# Altium schematic sheet Motor_Drive.SchDoc: TITRE
size Letter; ApprovedBy: APPROUVÉ PAR; Organization: Cegep Limoilou; Address1: 1300, 8e Avenue; Address2: Québec, QC; Address3: Canada; Address4: G1J 5L5; SheetNumber: 3; SheetTotal: 3
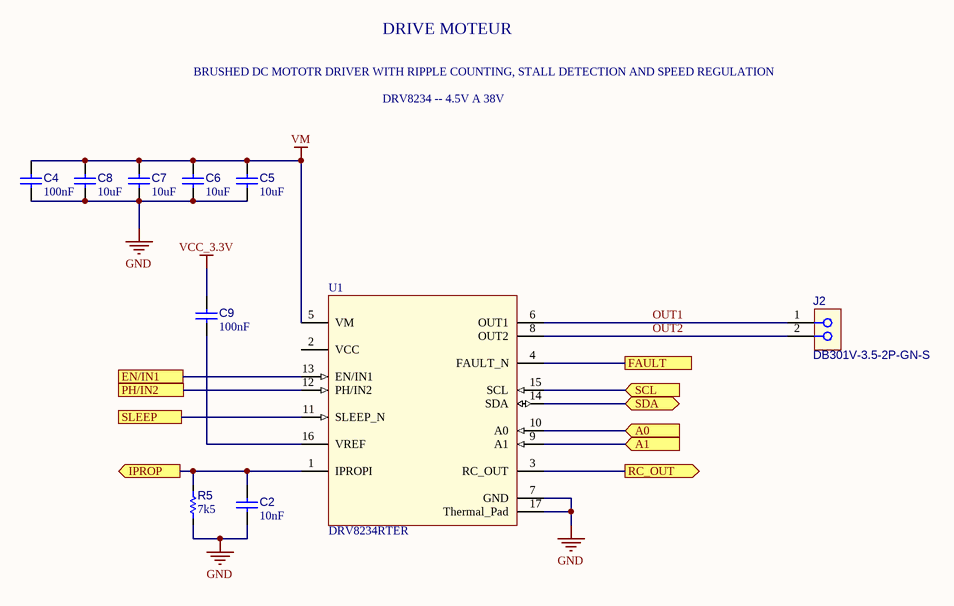
[diagram p0: Motor_Drive.SchDoc]

## Parts
C2  value 10nF  [C_1608[0603]]  (hidden comment: CAP CER 10nF 50V 0603)
C4  value 100nF  [C_2012[0805]]  (hidden comment: CAP CER 100nF 50V 0805)
C5  value 10uF  [C_2012[0805]]  (hidden comment: CAP CER 10uF 10V X7R 0805)
C6  value 10uF  [C_2012[0805]]  (hidden comment: CAP CER 10uF 10V X7R 0805)
C7  value 10uF  [C_2012[0805]]  (hidden comment: CAP CER 10uF 10V X7R 0805)
C8  value 10uF  [C_2012[0805]]  (hidden comment: CAP CER 10uF 10V X7R 0805)
C9  value 100nF  [C_2012[0805]]  (hidden comment: CAP CER 100nF 50V 0805)
J2  DB301V-3.5-2P-GN-S  [CONN_TERM_BLOCK_2POS_3mm5]
R5  value 7k5  [R_1005[0402]]  (hidden comment: Res 7k5 1% 0402)
U1  DRV8234RTER  [U_WQFN50P300X300-16]

## Ports
A0 (in), A1 (in), EN/IN1, FAULT, IPROP (out), PH/IN2, RC_OUT (out), SCL (in), SDA (bidir), SLEEP

## Nets
GND: C2.1 C4.1 C5.2 C6.1 C7.2 C8.1 R5.1 U1.7(GND) U1.17(Thermal_Pad)
VCC_3.3V: C9.2
VM: C4.2 C5.1 C6.2 C7.1 C8.2 U1.5(VM)
A0: U1.10(A0) ; port A0
A1: U1.9(A1) ; port A1
EN/IN1: U1.13(EN/IN1) ; port EN/IN1
FAULT: U1.4(FAULT_N) ; port FAULT
IPROP: C2.2 R5.2 U1.1(IPROPI) ; port IPROP
OUT1: J2.1 U1.6(OUT1)
OUT2: J2.2 U1.8(OUT2)
PH/IN2: U1.12(PH/IN2) ; port PH/IN2
RC_OUT: U1.3(RC_OUT) ; port RC_OUT
SCL: U1.15(SCL) ; port SCL
SDA: U1.14(SDA) ; port SDA
SLEEP: U1.11(SLEEP_N) ; port SLEEP
NetC9_1: C9.1 U1.16(VREF)

Not connected (* = marked no-connect by the designer): U1 2(VCC)

## Notes on the sheet
- BRUSHED DC MOTOTR DRIVER WITH RIPPLE COUNTING, STALL DETECTION AND SPEED REGULATION
- DRIVE MOTEUR
- DRV8234 -- 4.5V A 38V
- Titre :
- Conception :
- Date :
- Approbation :
- Heure :
- Révision :
- Feuille
- de
- Fichier :

## Library data of the parts
C2 = CAP007: Capacitor type 1; Manufacturer 1: Yageo; Manufacturer Part Number 1: CC0603KRX7R9BB103; LibRef: CAP007; Tolerance: 10%; Dielectric: X7R; Rated Voltage: 50V; Mounting Technology: SMT; Supplier 1: LCSC; Supplier Part Number 1: C100042
C4 C9 = CAP008: Capacitor type 1; Manufacturer 1: Yageo; Manufacturer Part Number 1: CC0805KRX7R9BB104; LibRef: CAP008; Code CEGEP: KCOND0142SM; Tolerance: 10%; Dielectric: X7R; Rated Voltage: 50V; Mounting Technology: SMT; Supplier 1: LCSC; Supplier Part Number 1: C49678
C5-C8 = CAP004: Capacitor type 1; Manufacturer 1: muRata; Manufacturer Part Number 1: GRM21BR71A106KE51L; LibRef: CAP004; Code CEGEP: KCOND03SM; Tolerance: 10%; Rated Voltage: 10V; Dielectric: X7R; Mounting Technology: SMT; Supplier 1: LCSC; Supplier Part Number 1: C86038
J2 = CONN-3MM5-2POS-TERM-BLOCK: CONN TERM BLOCK 2POS 3.5mm pitch; Manufacturer 1: Dorabo; Supplier 1: LCSC; Supplier Part Number 1: C695629; Manufacturer Part Number 1: DB301V-3.5-2P-GN-S; Mounting Technology: TH
R5 = RES027: Resistor type 1; Manufacturer 1: Yageo; Manufacturer Part Number 1: RC0402FR-077k5L; LibRef: RES027; Puissance: 1/16W; Max Working Voltage: 50V; Tolerance: 1%; Mounting Technology: SMT; Supplier 1: LCSC; Supplier Part Number 1: C137934
U1 = U_DRV8234: Brushed DC H-bridge Motor Driver with Ripple Counting, Stall Detection, and Speed Regulation 38V 2A 16-WQFN; Manufacturer 1: Texas Instruments; Mounting Technology: SMT; Manufacturer Part Number 1: DRV8234RTER; Supplier 1: LCSC